# Altium schematic sheet Sch_Sheet_Template.SchDoc: Sample Sheet Title
size B; Date: MM/DD/YYYY; Author: Sample Author; Organization: ORGANIZATION; Address1: ADDRESS 1; Address2: ADDRESS 2; Address3: ADDRESS 3; Address4: ADDRESS 4; Revision: -; SheetNumber: 2; SheetTotal: 6; ENG_APP_DATE: --/--/--; DSN_APP_DATE: --/--/--; CHK_APP_DATE: --/--/--
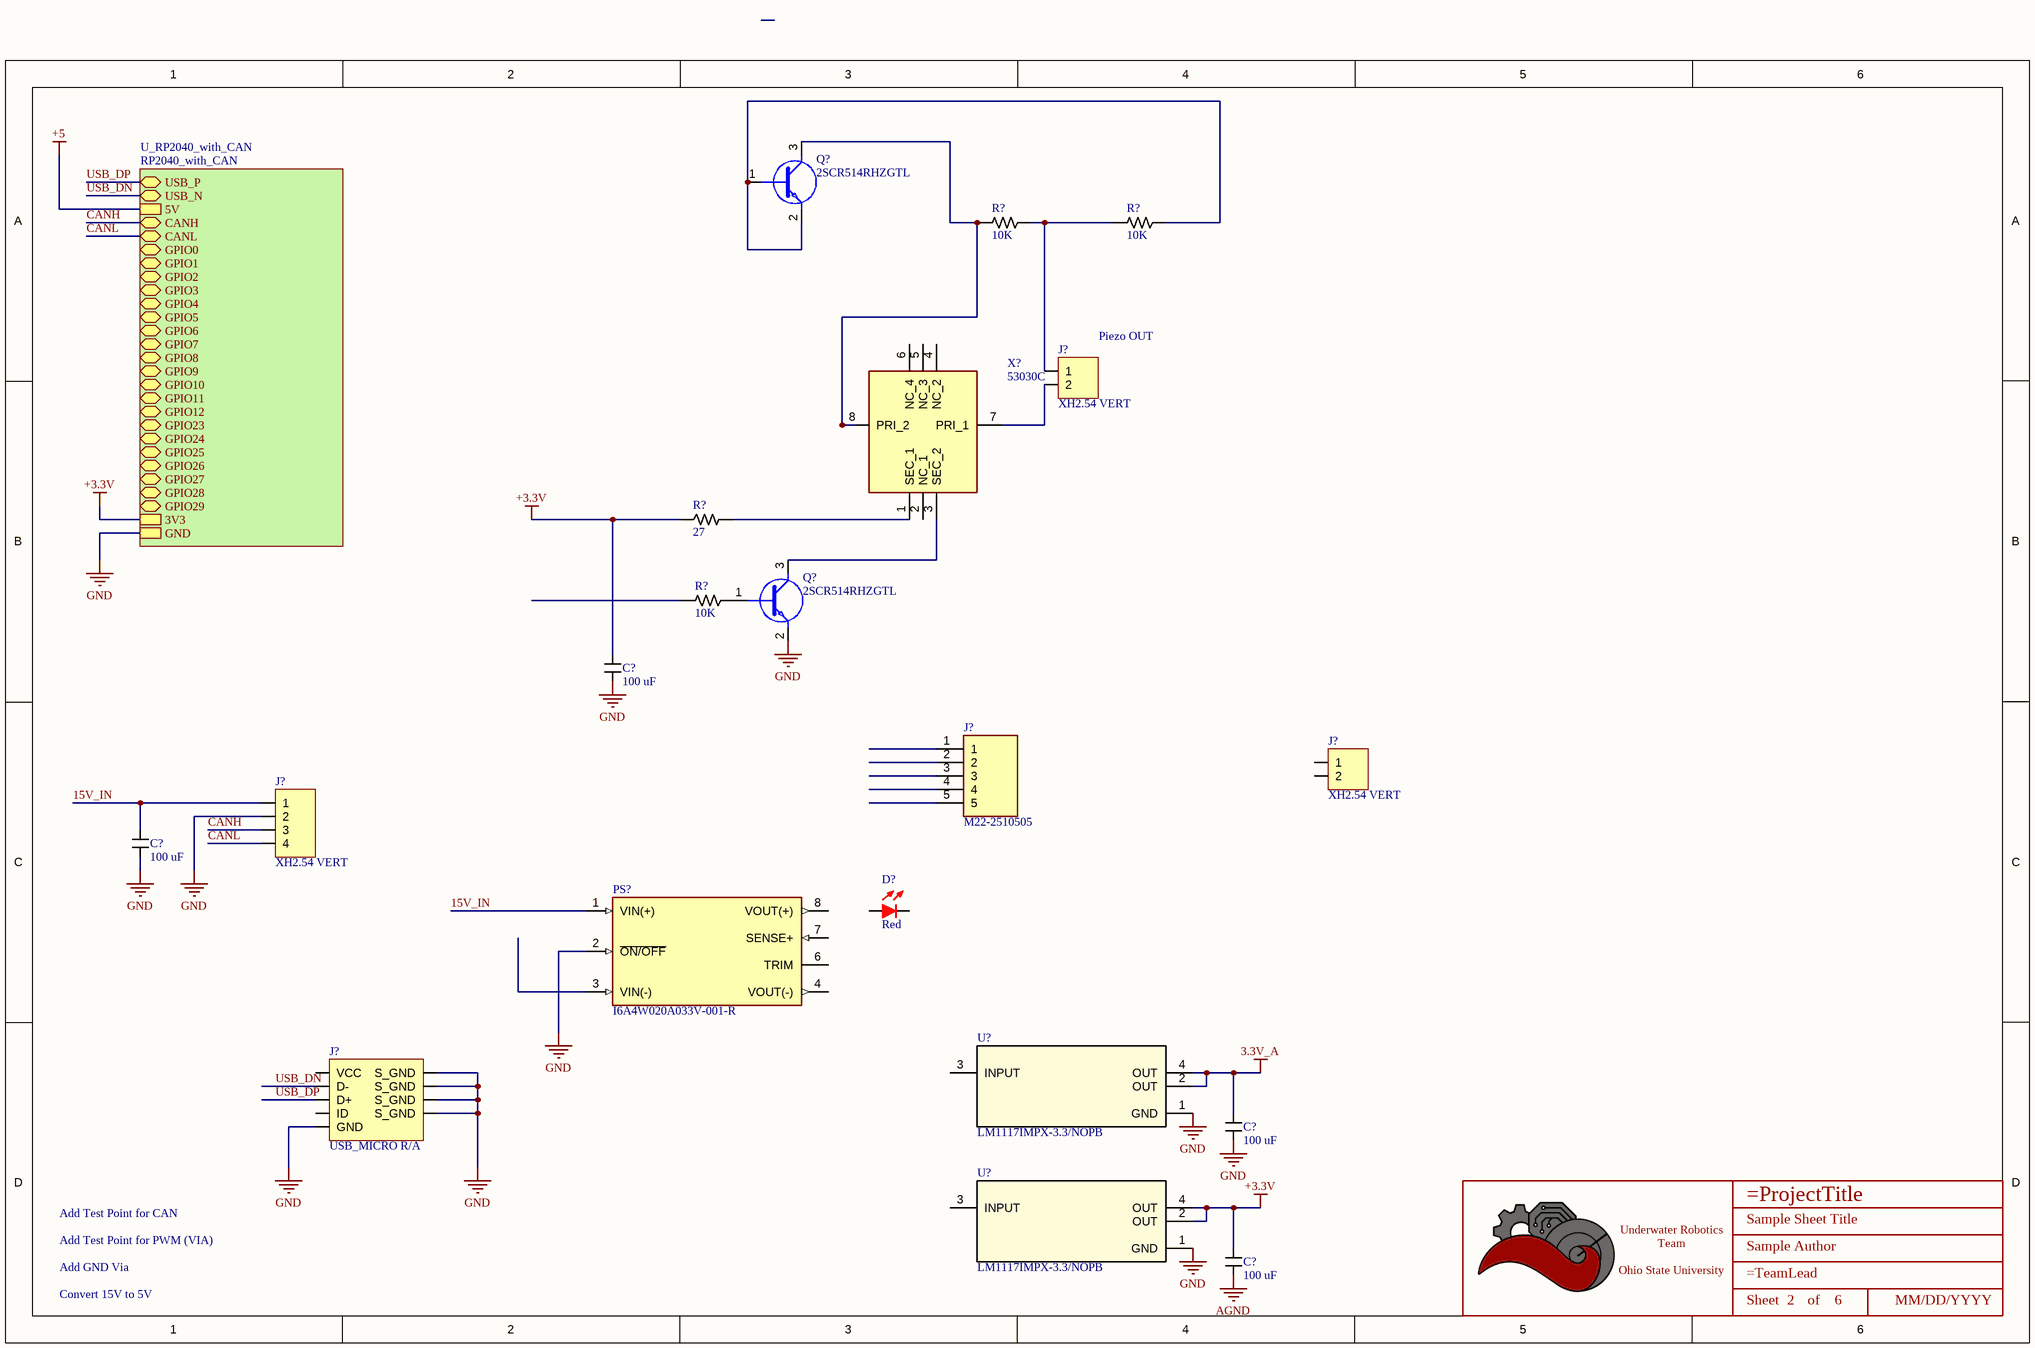
[diagram p0: Sch_Sheet_Template.SchDoc]

## Parts
(Parts that share a designator on the sheet are numbered #1, #2 ... from top to bottom, then left to right.)
*  Title_Block  [LOGO]  (value not drawn)  (graphical)
C?#1  Value (uF): 100 uF  [CAPACITOR_0603]  (hidden comment: 100uF Ceramic 6.3V)
C?#2  Value (uF): 100 uF  [CAPACITOR_0603]  (hidden comment: 100uF Ceramic 6.3V)
C?#3  Value (uF): 100 uF  [CAPACITOR_0603]  (hidden comment: 100uF Ceramic 6.3V)
C?#4  Value (uF): 100 uF  [CAPACITOR_0603]  (hidden comment: 100uF Ceramic 6.3V)
D?  Color: Red  [LED_0603]  (hidden comment: 150060RS75000)
J?#1  XH2.54 VERT  [CONN_JST_XH254_2POS_VERT]
J?#2  M22-2510505  [HDRV5W50P0X200_1X5_1000X200X525P]
J?#3  XH2.54 VERT  [CONN_JST_XH254_2POS_VERT]
J?#4  XH2.54 VERT  [CONN_JST_XH254_4POS_VERT]
J?#5  USB_MICRO R/A  [CONN_MINIUSB]
PS?  I6A4W020A033V-001-R  [CONV_I6A4W020A033V-001-R]
Q?#1  2SCR514RHZGTL  [SOT95P280X100-3N]
Q?#2  2SCR514RHZGTL  [SOT95P280X100-3N]
R?#1  Value  (Ohms): 10K  [RESISTOR_0603]  (hidden comment: 10k Ohm 5% 1/10W)
R?#2  Value  (Ohms): 10K  [RESISTOR_0603]  (hidden comment: 10k Ohm 5% 1/10W)
R?#3  Value  (Ohms): 27  [RESISTOR_0603]  (hidden comment: 27 Ohm 5% 1/8W)
R?#4  Value  (Ohms): 10K  [RESISTOR_0603]  (hidden comment: 10k Ohm 5% 1/10W)
U?#1  LM1117IMPX-3.3/NOPB  [SOT-223-4]
U?#2  LM1117IMPX-3.3/NOPB  [SOT-223-4]
X?  53030C  [53030C]

## Sub-sheets
U_RP2040_with_CAN = RP2040_with_CAN: USB_P (bidir), USB_N (bidir), 5V, CANH (bidir), CANL (bidir), GPIO0 (bidir), GPIO1 (bidir), GPIO2 (bidir), GPIO3 (bidir), GPIO4 (bidir), GPIO5 (bidir), GPIO6 (bidir), GPIO7 (bidir), GPIO8 (bidir), GPIO9 (bidir), GPIO10 (bidir), GPIO11 (bidir), GPIO12 (bidir), GPIO23 (bidir), GPIO24 (bidir), GPIO25 (bidir), GPIO26 (bidir), GPIO27 (bidir), GPIO28 (bidir), GPIO29 (bidir), 3V3, GND

## Nets
3.3V_A: C?#3.1 U?#1.2(OUT) U?#1.4(OUT)
+3.3V: C?#1.1 C?#4.1 R?#3.2 U?#2.2(OUT) U?#2.4(OUT) ; sheet U_RP2040_with_CAN/3V3
+5: sheet U_RP2040_with_CAN/5V
AGND: C?#4.2
GND: C?#1.2 C?#2.2 C?#3.2 J?#4.2 J?#5.5(GND) J?#5.6(S_GND) J?#5.7(S_GND) J?#5.8(S_GND) J?#5.9(S_GND) PS?.2(~{ON/OFF}) Q?#2.2(E) U?#1.1(GND) U?#2.1(GND) ; sheet U_RP2040_with_CAN/GND
15V_IN: C?#2.1 J?#4.1 PS?.1(VIN(+))
CANH: J?#4.3 ; sheet U_RP2040_with_CAN/CANH
CANL: J?#4.4 ; sheet U_RP2040_with_CAN/CANL
USB_DN: J?#5.2(D-) ; sheet U_RP2040_with_CAN/USB_N
USB_DP: J?#5.3(D+) ; sheet U_RP2040_with_CAN/USB_P
NetJ?#1_1: J?#1.1 R?#1.2 R?#2.1
NetJ?#1_2: J?#1.2 X?.7(PRI_1)
NetQ?#1_1: Q?#1.1(B) Q?#1.2(E) R?#2.2
NetQ?#1_3: Q?#1.3(C) R?#1.1 X?.8(PRI_2)
NetQ?#2_1: Q?#2.1(B) R?#4.2
NetQ?#2_3: Q?#2.3(C) X?.3(SEC_2)
NetR?#3_1: R?#3.1 X?.1(SEC_1)

Not connected (* = marked no-connect by the designer): D? 1 2; J?#2 1 2 3 4 5; J?#3 1 2; J?#5 1(VCC) 4(ID); PS? 3(VIN(-)) 4(VOUT(-)) 6(TRIM) 7(SENSE+) 8(VOUT(+)); R?#4 1; U?#1 3(INPUT); U?#2 3(INPUT); X? 2(NC_1) 4(NC_2) 5(NC_3) 6(NC_4)

## Notes on the sheet
- (near J?#1) Piezo OUT
- Add Test Point for CAN
- Add Test Point for PWM (VIA)
- Add GND Via
- Convert 15V to 5V
- DWG. NO.
- REV.
- SHT.
- THIS DOCUMENT AND THE DATA DISCLOSED HEREIN OR HEREWITH IS THE PROPERTY OF ALTIUM LIMITED AND MAY BE FREELY DISTRIBUTED IN WHOLE. NO RIGHTS ARE RESERVED OR EXPRESS OR IMPLIED WARANTEE GIVEN.
- REVISION
- DESCRIPTION
- DATE
- APPROVED
- ENG:
- APPROVALS
- PROJECT
- DSN:
- CHK:
- REFERENCE DOCUMENTS
- PROJECT REVISION:
- TITLE
- DOCUMENT REVISION:
- DESIGN ITEM:
- BOM:
- FAB DWG:
- PCB DWG:
- ASSY DWG:
- SCALE:
- SIZE
- B
- CAGE CODE
- FILE NAME
- DWG NO.
- SHEET
- OF
- REV
- (in symbol Title_Block) Underwater Robotics Team / Ohio State University; Sheet; of

## Library data of the parts
* = Title_Block: UWRT Schematic Title Block Template / Created June 2021, Dylan Trainor
C?#1-C?#4 = CAPACITOR_100uF_0603: Cap 100uF 6.3V +/-20% / Ceramic 0603; Made By: Dylan Trainor; ComponentLink1Description: Digikey; ComponentLink1URL: https://www.digikey.com/en/products/detail/samsung-electro-mechanics/CL10A106MQ8NNNC/3886777; Tolerance: +/- 20%; Voltage: 6.3V; Supplier 1: RSComponents; Supplier Part Number 1: 6911206
D? = LED_Red_0603: LED Red Vf= 2V If = 0.020A / 150060RS75000; Made By: Robert Pafford; Forward Current: 20mA; Forward Voltage: 2V; Package: 0603; Supplier 1: Digi-Key; Supplier Part Number 1: 732-4978-1-ND
J?#1 J?#3 = CONN_JST_XH254_2POS_VERT: JST XH 2.54mm Pitch 2 Pos Vertical; Current Per Pin: 4A; Number of Positions: 2; NOTE: Do not use JST 2.5mm parts with this footprint. JST does not make 2.54mm pitch pins, rather only clones make this connector!; Manufacturer: JST; Pitch: 2.54mm; Configuration: Vertical; Color: White; Created By: Robert P; Series: XH 2.54; ComponentLink1Description: Purchase Link; ComponentLink1URL: https://www.amazon.com/460PCS-XH2-54-Connector-Terminal-Connectors/dp/B09DBGVX5C
J?#2 = M22-2510505: Connector; Manufacturer_Name: Harwin; Datasheet Link: https://cdn.harwin.com/pdfs/M22-251.pdf; Height: 5.25mm; Manufacturer_Part_Number: M22-2510505; Mouser Part Number: 855-M22-2510505; Mouser Price/Stock: https://www.mouser.co.uk/ProductDetail/Harwin/M22-2510505?qs=WS5Jv%252B%252Bx1qWs6dQLMQlLFg%3D%3D
J?#4 = CONN_JST_XH254_4POS_VERT: JST XH 2.54mm Pitch 4 Pos Vertical; Current Per Pin: 4A; Number of Positions: 4; NOTE: Do not use JST 2.5mm parts with this footprint. JST does not make 2.54mm pitch pins, rather only clones make this connector!; Manufacturer: JST; Pitch: 2.54mm; Configuration: Vertical; Color: White; Created By: Robert P; Series: XH 2.54; ComponentLink1Description: Purchase Link; ComponentLink1URL: https://www.amazon.com/460PCS-XH2-54-Connector-Terminal-Connectors/dp/B09DBGVX5C
J?#5 = CONN_MICROUSB: Amphenol Micro USB-B / USB2.0 5 Pin Right Angle SMD; Pitch: 0.65mm; Current Per Pin: 1.8A; Number of Positions: 5; Manufacturer: Amphenol; Configuration: Right Angle; Color: Silver; Created By: Flip B; ComponentLink1Description: Datasheet; ComponentLink1URL: https://cdn.amphenol-icc.com/media/wysiwyg/files/documentation/datasheet/inputoutput/io_usb_micro.pdf?__cf_chl_jschl_tk__=05693735e19256298f6ef6ca2bb2e65c376a4f56-1625503833-0-Abitsb0-ufjOXJYs_S3J3r2iTn-nObalbmXUksF1VvO_h_WEmRdMlUD1I8-hmWSEVWzY1pirKnrPZWfgY3851qyBZe5ZvnNQePLGIzUgdEIQBVUyW36RsbYpDLEWxJ4horD-5gChFgobLYqwmG5aHl0E8lIn_twwPPrOxilK2gP0q9t_CNOs_u5fMqXvXUrlsOv8tIE2NRlu6NVP8qtkL2GjhlkeTUbDMF8WvvpPDTFOgvZ4Y16Ej8F8AhWos88mo5B1HssXozw0XrkJQIqERITUu6rqloz9kf4ZzhBHtDAt-IkiAFY_Ds9SW8FYKKTtINJVpHZQ6Gyu1FFM4Dc9MO0maE8_mmNcwlxqyRoRk_MPWW8VyByXWM5RSp52jteRKw7FeI9WIYvCbPAOy0Eyib-aseIQsnGbglBcUY6_2xp8GYaJM38H3dNvBPsSOfJBPndKedwKHllxjkucXn6xsN0sDXkpGN-cu8_2bDTJ0g-uUucKSCooYX-ApSDNGpkA_p9zv1SOAD8c0zaZVmtiBsN75QpVz2rzq9_BFxOywPvR; Series: 10118192; Supplier 1: Digi-Key; Supplier Part Number 1: 609-4613-1-ND
PS? = I6A4W020A033V-001-R: Non-Isolated PoL Module DC DC Converter 1 Output 3.3 ~ 15V 20A 9V - 53V Input; MF: TDK-Lambda Americas; Availability: In Stock; Price: None; Package: DIP-8 TDK-Lambda; MP: I6A4W020A033V-001-R; Value: *; SnapEDA_Link: https://www.snapeda.com/parts/I6A4W020A033V-001-R/TDK-Lambda%20Americas%20Inc./view-part/1737324/?ref=snap; Check_prices: https://www.snapeda.com/parts/I6A4W020A033V-001-R/TDK-Lambda%20Americas%20Inc./view-part/1737324/?ref=eda; Purchase-URL: https://pricing.snapeda.com/search/part/I6A4W020A033V-001-R/?ref=eda
Q?#1 Q?#2 = 2SCR514RHZGTL: Bipolar (BJT) Transistor NPN 80 V 700 mA 320MHz 500 mW Surface Mount TSMT3; Manufacturer_Name: ROHM Semiconductor; Geometry.Height: 1mm; Mouser Part Number: 755-2SCR514RHZGTL; Mouser Price/Stock: https://www.mouser.co.uk/ProductDetail/ROHM-Semiconductor/2SCR514RHZGTL?qs=Znm5pLBrcAJoNmVRhw7gxA%3D%3D; Manufacturer_Part_Number: 2SCR514RHZGTL; Datasheet Link: *
R?#1 R?#2 R?#4 = RESISTOR_10K_0603: RES 10k OHM 5% 1/10W 0603; Tolerance: +/- 5%; Wattage: 1/8W; Made By: Robert Pafford; ComponentLink1Description: Datasheet; ComponentLink1URL: https://www.bourns.com/docs/product-datasheets/CRxxxxx.pdf; Supplier: Digikey; Digikey Part Numer: CR0603-JW-104ELFTR-ND; Supplier 1: Digi-Key; Supplier Part Number 1: 2019-RK73B1JTTD103JCT-ND
R?#3 = RESISTOR_27_0603: RES 27 OHM 5% 1/8W 0603; Tolerance: +/- 5%; Made By: Robert Pafford; ComponentLink1Description: Datasheet; ComponentLink1URL: https://www.bourns.com/docs/product-datasheets/CRxxxxx.pdf; Wattage: 1/8W; Supplier: Digikey; Digikey Part Numer: CR0603-JW-104ELFTR-ND; Supplier 1: Digi-Key; Supplier Part Number 1: 2019-RK73B1JTTD270JCT-ND
U?#1 U?#2 = LM1117IMPX-3.3/NOPB: IC REG LIN 3.3V 800MA SOT223-4; PartNumber: LM1117IMP-3.3/NOPB; Manufacturer: Texas Instruments; Vin (Max): 15V; Supplier 1: Digi-Key; Supplier Part Number 1: LM1117IMPX-3.3/NOPBCT-ND; Vout (Min/Fixed): 3.3V; Amp Out: 800mA; Package: SOT-223-4; Created By: Dylan T
X? = 53030C: Current Transformers 10A Curr Sense Txfr 1:30 SM; Manufacturer_Name: Murata Electronics; Geometry.Height: 5.4mm; Mouser Part Number: 580-53030C; Mouser Price/Stock: https://www.mouser.com/Search/Refine.aspx?Keyword=580-53030C; Manufacturer_Part_Number: 53030C; Datasheet Link: https://componentsearchengine.com/Datasheets/1/53030C.pdf